# EAGLE design fbd-v1 (EAGLE 7.1.0)
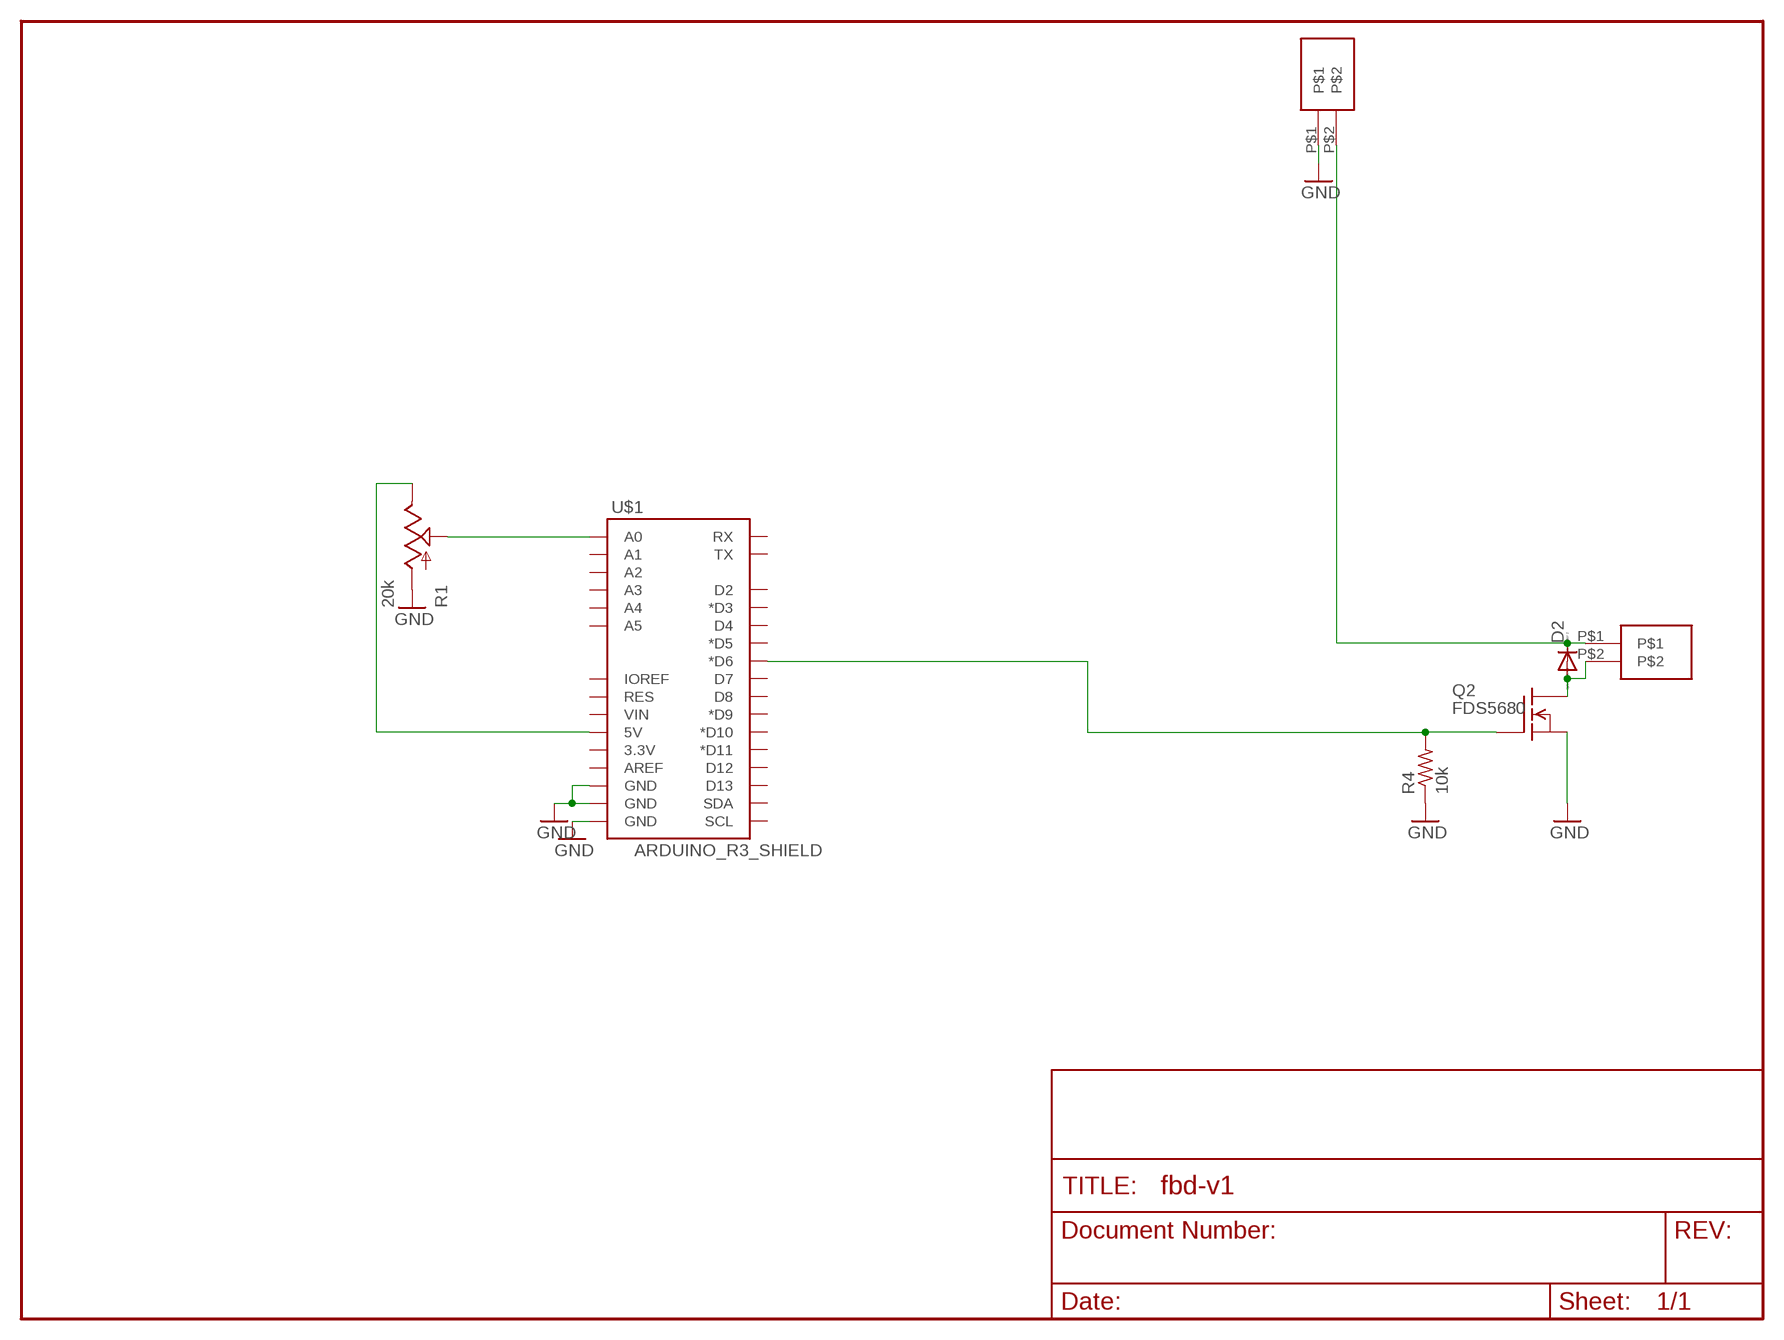
[diagram p0: schematic, sheet 1]

## Parts
D2  DIODE-DO-214AC  [DO-214AC]
Q2  FDS5680  [SO-8]
R1  20k  POTALPS-KIT  [ALPS_POT_KIT]
R4  10k  R-US_R0603  [R0603]
U$1  ARDUINO_R3_SHIELD  [UNO_R3_SHIELD]
X3  SPRING-TERMINAL  [SPRING-TERMINAL]
X5  SPRING-TERMINAL  [SPRING-TERMINAL]

## Nets
GND: Q2.1(S) Q2.2(S) Q2.3(S) R1.P$3(A) R4.1 U$1.GND@0(GND) U$1.GND@1(GND) U$1.GND@2(GND) X3.P$1
N$1: R1.P$2(S) U$1.A0
N$4: R1.P$1(E) U$1.5V
N$12: D2.A Q2.5(D) Q2.6(D) Q2.7(D) Q2.8(D) X5.P$2
N$14: Q2.4(G) R4.2 U$1.D6(*D6)
X4 [vcc]: D2.C X3.P$2 X5.P$1
Unconnected: U$1.3.3V U$1.A1 U$1.A2 U$1.A3 U$1.A4 U$1.A5 U$1.AREF U$1.D2 U$1.D3(*D3) U$1.D4 U$1.D5(*D5) U$1.D7 U$1.D8 U$1.D9(*D9) U$1.D10(*D10) U$1.D11(*D11) U$1.D12 U$1.D13 U$1.IOREF U$1.RES U$1.RX U$1.SCL U$1.SDA U$1.TX U$1.VIN

## Library data of the parts
D2 = diode:DIODE-: DIODE
Q2 = transistor-fet:FDS5680: 60V N-Channel PowerTrench TM MOSFET FAIRCHILD FDS5680.pdf
R1 = SparkFun-Electromechanical:POT
R4 = resistor:R-US_: RESISTOR, American symbol
U$1 = SparkFun-Boards:ARDUINO_R3_SHIELD: Shield form compatible with the Arduino Uno R3.
X3 X5 = spietz-library:SPRING-TERMINAL

## Net classes
0 default: width 0.203 mm
1 vcc: width 0.254 mm

## Board
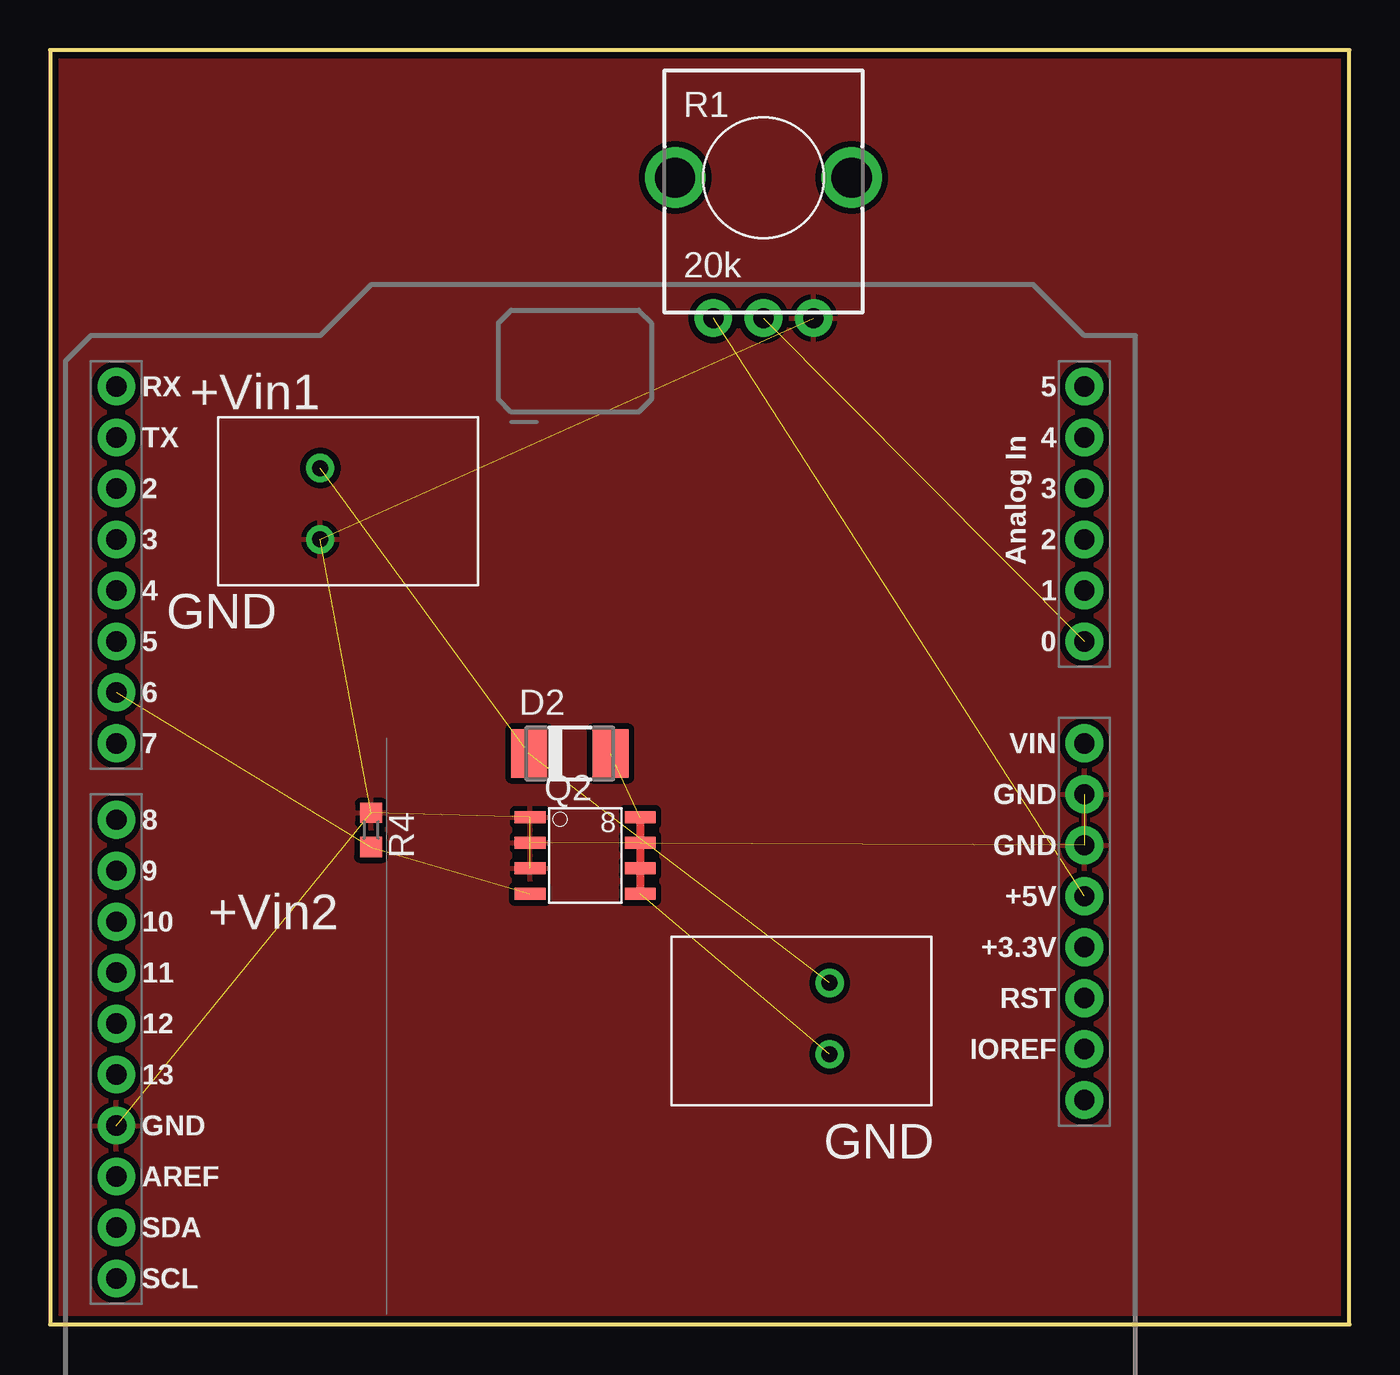
[diagram p1: board, top side]
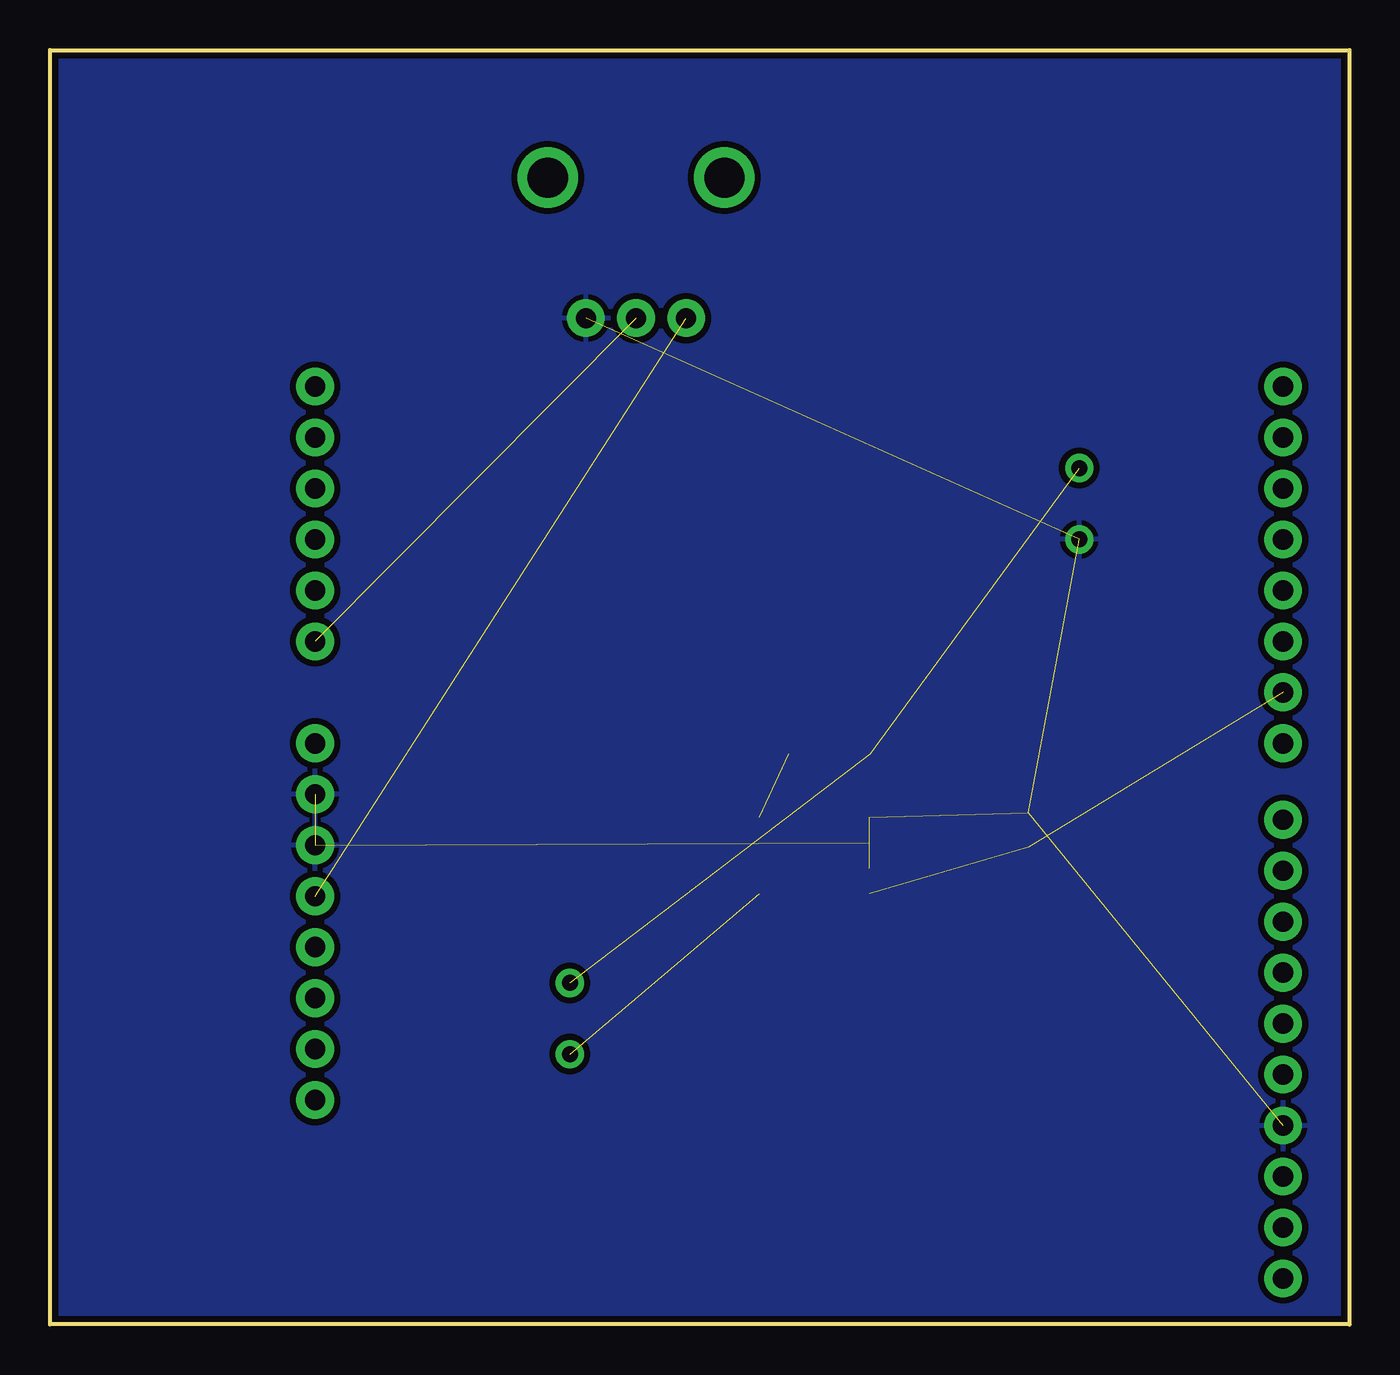
[diagram p2: board, bottom side, seen from below]

Size 64.77 x 63.5 mm. Coordinates in mm from the lower left corner, seen from the top.
Outline: 0,63.5 0,0 64.77,0 64.77,63.5 0,63.5
Copper layers (1*16): Top 0.035mm / dielectric 1.5mm / Bottom 0.035mm
Design rules "default": minimum track width 8mil, minimum drill 20mil, track to track 8mil, track to pad 8mil, pad to pad 8mil, via to via 8mil, smd to smd 8mil, copper to edge 10mil, drill to drill 8mil, minimum pad ring 12mil, minimum via ring 10mil, stop-mask expansion 4mil, vias tented up to drill 25mil, thermal gap 10mil

### Footprints (pad centres in the part's own frame; a part is rotated, then mirrored left to right if it is on the bottom)
DO-214AC = smd 1.8 x 2.4: A 2.025,0; C -2.025,0
SO-8 = smd 1.524 x 0.61: 1 -2.743,1.905; 2 -2.743,0.635; 3 -2.743,-0.635; 4 -2.743,-1.905; 5 2.743,-1.905; 6 2.743,-0.635; 7 2.743,0.635; 8 2.743,1.905
ALPS_POT_KIT = drill 1 pad 1.88: P$1 7,-2.5; P$2 7,0; P$3 7,2.5 | drill 2: P$4 0,-4.4; P$5 0,4.4
R0603 = smd 1 x 1.1: 1 -0.85,0; 2 0.85,0
UNO_R3_SHIELD = drill 1.016 pad 1.88: 3.3V 50.8,26.67; 5V 50.8,29.21; A0 50.8,41.91; A1 50.8,44.45; A2 50.8,46.99; A3 50.8,49.53; A4 50.8,52.07; A5 50.8,54.61; AREF 2.54,15.24; D2 2.54,49.53; D3 2.54,46.99; D4 2.54,44.45; D5 2.54,41.91; D6 2.54,39.37; D7 2.54,36.83; D8 2.54,33.02; D9 2.54,30.48; D10 2.54,27.94; D11 2.54,25.4; D12 2.54,22.86; D13 2.54,20.32; GND@0 50.8,31.75; GND@1 50.8,34.29; GND@2 2.54,17.78; IOREF 50.8,21.59; NC 50.8,19.05; RES 50.8,24.13; RX 2.54,54.61; SCL 2.54,10.16; SDA 2.54,12.7; TX 2.54,52.07; VIN 50.8,36.83
SPRING-TERMINAL = drill 0.8: P$1 5.08,1.778; P$2 5.08,5.334

### Placement (x,y rotation side)
D2  25.91,28.45 0 top
Q2  26.67,23.37 0 top
R1  35.56,57.15 270 top
R4  16,24.64 270 top
U$1  0.76,-7.87 0 top
X3  8.38,37.34 0 top
X5  43.94,18.8 180 top

### Tracks (layer width: path | path; a pad name or v marks a point on that pad's centre or on a via)
GND  (8 unrouted)
  pour Top (isolate 0.305): 0,63.5 64.77,63.5 64.77,0 0,0
  pour Bottom (isolate 0.305): 0,63.5 64.77,63.5 64.77,0 0,0
N$1  (1 unrouted)
N$4  (1 unrouted)
N$12  (2 unrouted)
  Top 0.406: Q2.8 Q2.7 Q2.6 Q2.5
N$14  (2 unrouted)
X4  (2 unrouted)

### Text on the board
tPlace: +Vin1 | GND | +Vin2 | GND
tValues: Tent Vias! | Arduino Wee v1.3